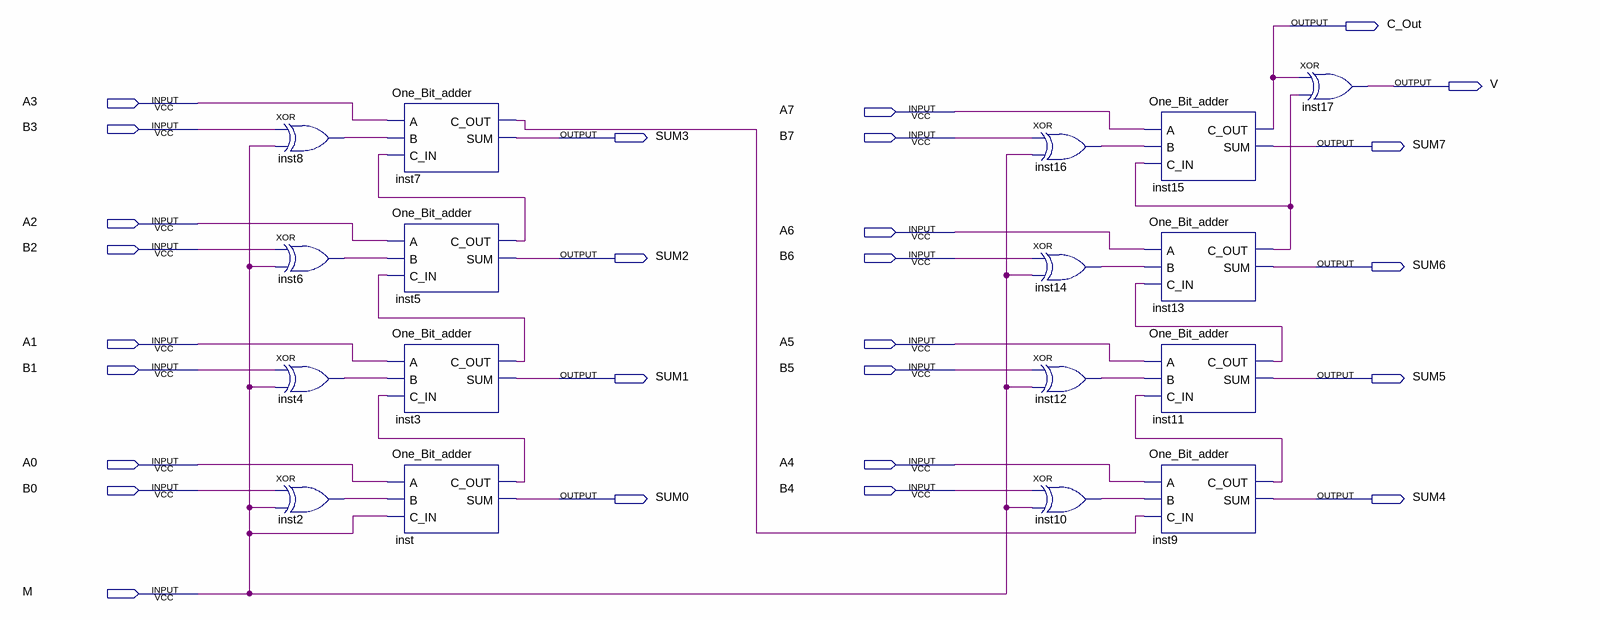
[diagram p0: schematic sheet]
// Quartus schematic Signed_Adder.bdf as structural Verilog: 17 symbols, 27 pins
module Signed_Adder (
  input  A3,
  input  A7,
  input  B3,
  input  B7,
  input  A2,
  input  A6,
  input  B2,
  input  B6,
  input  A1,
  input  A5,
  input  B1,
  input  B5,
  input  A0,
  input  A4,
  input  B0,
  input  B4,
  input  M,
  output C_Out,
  output V,
  output SUM3,
  output SUM7,
  output SUM2,
  output SUM6,
  output SUM1,
  output SUM5,
  output SUM0,
  output SUM4
);

  wire inst2_out, inst3_c_out, inst4_out, inst5_c_out, inst6_out, inst7_c_out, inst8_out, inst9_c_out,
       inst10_out, inst11_c_out, inst12_out, inst13_c_out, inst14_out, inst16_out, inst_c_out;

  xor inst8 (inst8_out, B3, M);
  xor inst6 (inst6_out, B2, M);
  xor inst4 (inst4_out, B1, M);
  xor inst2 (inst2_out, B0, M);
  One_Bit_adder inst7 (.A(A3), .B(inst8_out), .C_IN(inst5_c_out), .C_OUT(inst7_c_out), .SUM(SUM3));
  One_Bit_adder inst5 (.A(A2), .B(inst6_out), .C_IN(inst3_c_out), .C_OUT(inst5_c_out), .SUM(SUM2));
  One_Bit_adder inst3 (.A(A1), .B(inst4_out), .C_IN(inst_c_out), .C_OUT(inst3_c_out), .SUM(SUM1));
  One_Bit_adder inst (.A(A0), .B(inst2_out), .C_IN(M), .C_OUT(inst_c_out), .SUM(SUM0));
  xor inst16 (inst16_out, B7, M);
  xor inst14 (inst14_out, B6, M);
  xor inst12 (inst12_out, B5, M);
  xor inst10 (inst10_out, B4, M);
  One_Bit_adder inst15 (.A(A7), .B(inst16_out), .C_IN(inst13_c_out), .C_OUT(C_Out), .SUM(SUM7));
  One_Bit_adder inst13 (.A(A6), .B(inst14_out), .C_IN(inst11_c_out), .C_OUT(inst13_c_out), .SUM(SUM6));
  One_Bit_adder inst11 (.A(A5), .B(inst12_out), .C_IN(inst9_c_out), .C_OUT(inst11_c_out), .SUM(SUM5));
  One_Bit_adder inst9 (.A(A4), .B(inst10_out), .C_IN(inst7_c_out), .C_OUT(inst9_c_out), .SUM(SUM4));
  xor inst17 (V, C_Out, inst13_c_out);
endmodule
